# EAGLE design pixEmilyPdb (EAGLE 7.6.0)
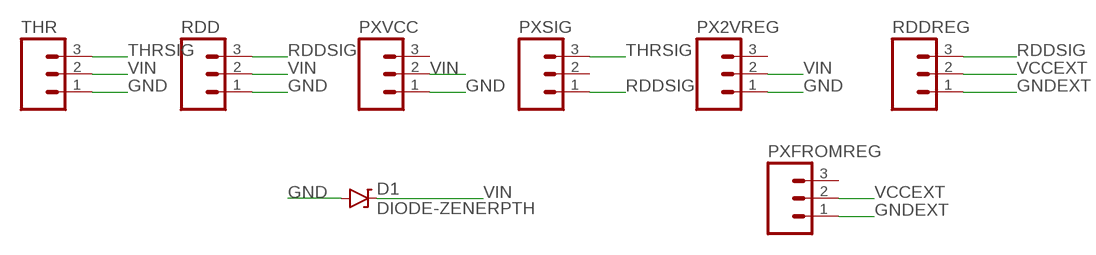
[diagram p0: schematic, sheet 1]

## Parts
D1  DIODE-ZENERPTH  [DIODE-ZENER]
PX2VREG  M03PTH  [1X03]
PXFROMREG  M03PTH  [1X03]
PXSIG  M03PTH  [1X03]
PXVCC  M03PTH  [1X03]
RDD  M03PTH  [1X03]
RDDREG  M03PTH  [1X03]
THR  M03PTH  [1X03]

## Nets
GND: D1.P$2(A) PX2VREG.1 PXVCC.1 RDD.1 THR.1
GNDEXT: PXFROMREG.1 RDDREG.1
RDDSIG: PXSIG.1 RDD.3 RDDREG.3
THRSIG: PXSIG.3 THR.3
VCCEXT: PXFROMREG.2 RDDREG.2
VIN: D1.P$1(C) PX2VREG.2 PXVCC.2 RDD.2 THR.2
Unconnected: PX2VREG.3 PXFROMREG.3 PXSIG.2 PXVCC.3

## Library data of the parts
D1 = SparkFun-DiscreteSemi:DIODE-ZENER: Zener Diode Production Part - 8199 3.4V Zener Voltage
PX2VREG PXFROMREG PXSIG PXVCC RDD RDDREG THR = SparkFun-Connectors:M03: Header 3 Standard 3-pin 0.1" header. Use with straight break away headers (SKU : PRT-00116), right angle break away headers (PRT-00553), swiss pins (PRT-00743), machine pins (PRT-00117), and female headers (PRT-00115). Molex polarized connector foot print use with SKU : PRT-08232 with associated crimp pins and housings.

## Board
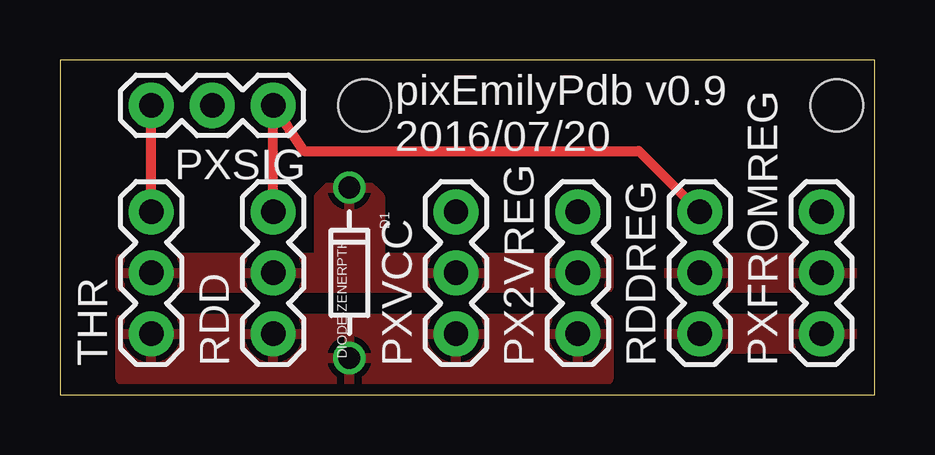
[diagram p1: board, top side]

Size 33.96 x 13.96 mm. Coordinates in mm from the lower left corner, seen from the top.
Outline: 0,0 33.96,0 33.96,13.96 0,13.96 0,0
Copper layers (1*16): Top 0.0356mm / dielectric 1.5011mm / Bottom 0.0356mm
Design rules "LaenPCBOrder": minimum track width 6mil, minimum drill 13mil, track to track 6mil, track to pad 6mil, pad to pad 6mil, via to via 6mil, smd to smd 6mil, copper to edge 15mil, drill to drill 6mil, minimum pad ring 7mil, minimum via ring 7mil, stop-mask expansion 3mil, vias tented up to drill 0mil, thermal gap 10mil
Holes 2.18 mm at 32.38,12.06 12.7,12.06

### Footprints (pad centres in the part's own frame; a part is rotated, then mirrored left to right if it is on the bottom)
DIODE-ZENER = drill 0.9: P$1 -3.556,0; P$2 3.556,0
1X03 = drill 1.016 pad 1.88: 1 0,0; 2 2.54,0; 3 5.08,0

### Placement (x,y rotation side)
D1  12.06,5.08 270 top
PX2VREG  21.59,2.54 90 top
PXFROMREG  31.75,2.54 90 top
PXSIG  8.89,12.06 180 top
PXVCC  16.51,2.54 90 top
RDD  8.89,2.54 90 top
RDDREG  26.67,2.54 90 top
THR  3.81,2.54 90 top

### Tracks (layer width: path | path; a pad name or v marks a point on that pad's centre or on a via)
GND
  pour Top: 2.54,3.17 22.86,3.17 22.86,0.64 2.54,0.64
GNDEXT
  pour Top: 25.4,3.17 33.02,3.17 33.02,1.91 25.4,1.91
RDDSIG
  Top 0.406: RDD.3 PXSIG.1 10.16,10.16 24.13,10.16 RDDREG.3
THRSIG
  Top 0.406: THR.3 PXSIG.3
VCCEXT
  pour Top: 25.4,4.45 25.4,5.71 33.02,5.71 33.02,4.45
VIN
  pour Top: 2.54,5.71 10.79,5.71 10.79,8.26 11.43,8.89 12.7,8.89 13.34,8.26 13.34,5.71 22.86,5.71 22.86,4.45 2.54,4.45

### Text on the board
tNames: pixEmilyPdb v0.9 / 2016/07/20